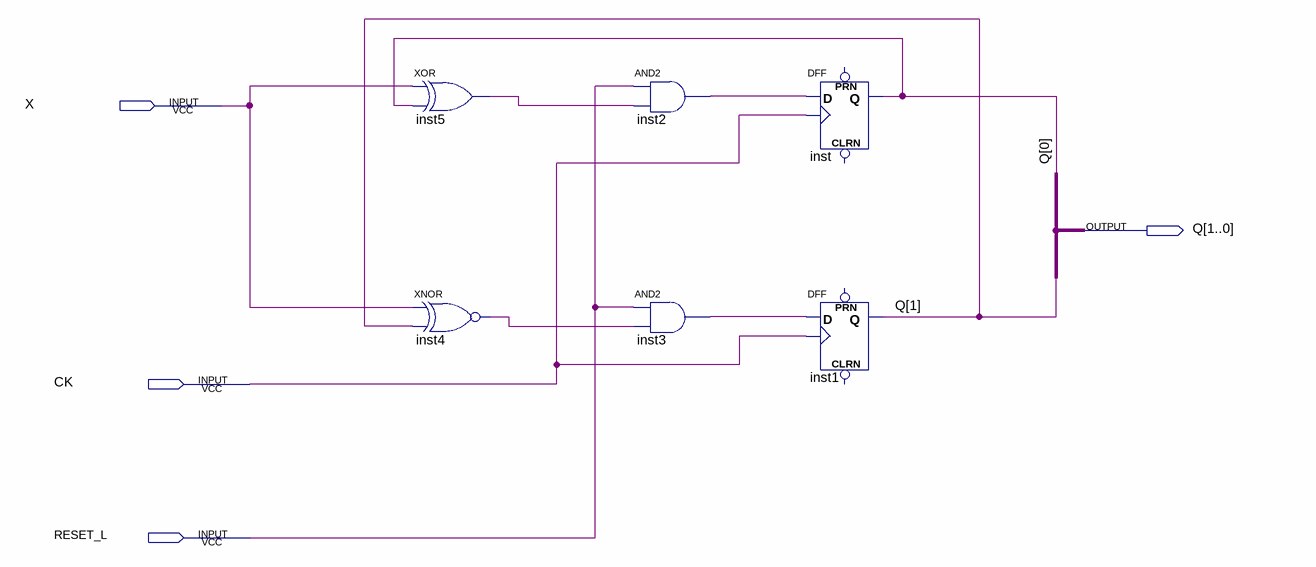
[diagram p0: schematic sheet]
// Quartus schematic x1_relogio_x0_contrario.bdf as structural Verilog: 6 symbols, 4 pins
module x1_relogio_x0_contrario (
  input  X,
  input  CK,
  input  RESET_L,
  output [1:0] Q
);

  wire inst2_out, inst3_out, inst4_out, inst5_out;

  xor inst5 (inst5_out, X, Q[0]);
  xnor inst4 (inst4_out, X, Q[1]);
  and inst2 (inst2_out, RESET_L, inst5_out);
  and inst3 (inst3_out, RESET_L, inst4_out);
  DFF inst (.CLK(CK), .D(inst2_out), .Q(Q[0]));  // open: CLRN, PRN
  DFF inst1 (.CLK(CK), .D(inst3_out), .Q(Q[1]));  // open: CLRN, PRN
endmodule
